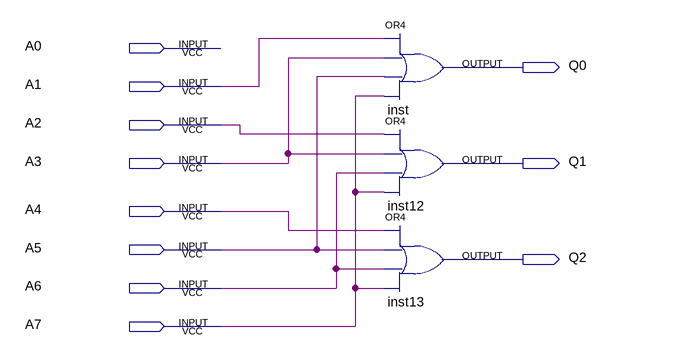
[diagram p0: schematic sheet]
// Quartus schematic s1111408_lab02_2.bdf as structural Verilog: 3 symbols, 11 pins
module s1111408_lab02_2 (
  input  A0,
  input  A1,
  input  A2,
  input  A3,
  input  A4,
  input  A5,
  input  A6,
  input  A7,
  output Q0,
  output Q1,
  output Q2
);

  or inst (Q0, A1, A3, A5, A7);
  or inst12 (Q1, A2, A3, A6, A7);
  or inst13 (Q2, A4, A5, A6, A7);
endmodule
